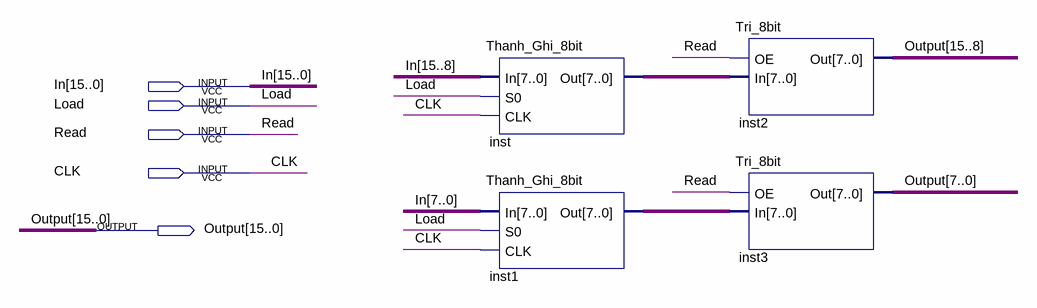
[diagram p0: schematic sheet]
// Quartus schematic Register_16bit.bdf as structural Verilog: 4 symbols, 5 pins
module Register_16bit (
  input  [15:0] In,
  input  Load,
  input  Read,
  input  CLK,
  output [15:0] Output
);

  wire [7:0] inst1_out, inst_out;

  Thanh_Ghi_8bit inst (.In(In[15:8]), .S0(Load), .CLK(CLK), .Out(inst_out));
  Thanh_Ghi_8bit inst1 (.In(In[7:0]), .S0(Load), .CLK(CLK), .Out(inst1_out));
  Tri_8bit inst2 (.OE(Read), .In(inst_out), .Out(Output[15:8]));
  Tri_8bit inst3 (.OE(Read), .In(inst1_out), .Out(Output[7:0]));
endmodule
